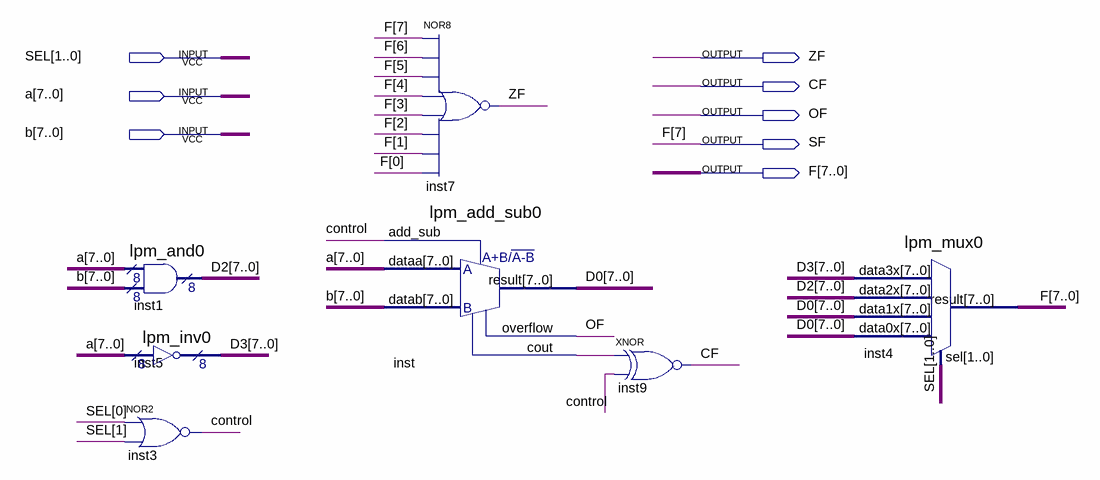
[diagram p0: schematic sheet]
// Quartus schematic ALU.bdf as structural Verilog: 7 symbols, 8 pins
module ALU (
  input  [1:0] SEL,
  input  [7:0] a,
  input  [7:0] b,
  output ZF,
  output CF,
  output OF,
  output SF,
  output [7:0] F
);

  wire control, inst_cout;
  wire [7:0] D0, D2, D3;

  lpm_and0 inst1 (.data0x(a), .data1x(b), .result(D2));
  lpm_inv0 inst5 (.data(a), .result(D3));
  nor inst3 (control, SEL[0], SEL[1]);
  lpm_add_sub0 inst (.dataa(a), .datab(b), .add_sub(control), .result(D0), .overflow(OF), .cout(inst_cout));
  nor inst7 (ZF, F[7], F[6], F[5], F[4], F[3], F[2], F[1], F[0]);
  xnor inst9 (CF, inst_cout, control);
  lpm_mux0 inst4 (.data3x(D3), .data2x(D2), .data1x(D0), .data0x(D0), .sel(SEL), .result(F));

  assign SF = F[7];
endmodule
